# Altium schematic sheet Switches.SchDoc
size A; SheetNumber: 7
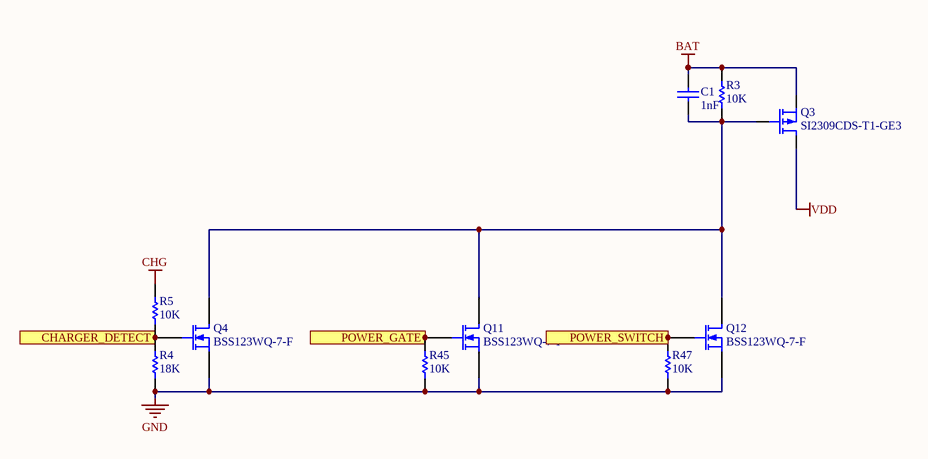
[diagram p0: Switches.SchDoc]

## Parts
C1  value 1nF  [C0603[1608X92]]  (hidden comment: 1nF 50V 0603)
Q3  SI2309CDS-T1-GE3  [SOT23-3]
Q4  BSS123WQ-7-F  [SOT323-3]
Q11  BSS123WQ-7-F  [SOT323-3]
Q12  BSS123WQ-7-F  [SOT323-3]
R3  value 10K  [R0603[1608]]  (hidden comment: 10K 1% 0603)
R4  value 18K  [R0603[1608]]  (hidden comment: 18K 1% 0603)
R5  value 10K  [R0603[1608]]  (hidden comment: 10K 1% 0603)
R45  value 10K  [R0603[1608]]  (hidden comment: 10K 1% 0603)
R47  value 10K  [R0603[1608]]  (hidden comment: 10K 1% 0603)

## Ports
CHARGER_DETECT (out), POWER_GATE (in), POWER_SWITCH (in)

## Nets
BAT: C1.2 Q3.3(S) R3.2
CHG: R5.2
GND: Q4.2(S) Q11.2(S) Q12.2(S) R4.1 R45.1 R47.1
VDD: Q3.2(D)
CHARGER_DETECT: Q4.1(G) R4.2 R5.1 ; port CHARGER_DETECT
POWER_GATE: Q11.1(G) R45.2 ; port POWER_GATE
POWER_SWITCH: Q12.1(G) R47.2 ; port POWER_SWITCH
NetC1_1: C1.1 Q3.1(G) Q4.3(D) Q11.3(D) Q12.3(D) R3.1

## Library data of the parts
C1 = CAP_1nF_50V_0603_5%: 1nF 50V 5% 0603 (1608 Metric); PartNumber: GRM1885C1H102JA01D; Manufacturer: Murata; TemperatureCoefficient: C0G; Mounting Technology: Surface Mount; PackageReference: 0603; PackageDescription: 0603 (1608 Metric); Voltage: 50V; Tolerance: 5%
Q3 = SI2309CDS-T1-GE3: P-Channel MOSFET; Manufacturer: Vishay; PackageReference: SOT23-3; Mounting Technology: Surface Mount; PartNumber: SI2309CDS-T1-GE3
Q4 Q11 Q12 = BSS123WQ-7-F: N-Channel MOSFET; Manufacturer: Diodes Incorporated; PackageReference: SOT-323-3; PartNumber: BSS123WQ-7-F; Mounting Technology: Surface Mount
R3 R5 R45 R47 = RES_10K_0603_1%: 10K 0.25W 1% 0603 (1005 Metric); Manufacturer: Vishay / Dale; PartNumber: CRCW060310K0FKEAHP; Power: 0.25W; Tolerance: 1%; Mounting Technology: Surface Mount; PackageReference: 0603; PackageDescription: 0603 (1608 Metric); ComponentLink1Description: Datasheet; ComponentLink1URL: http://www.vishay.com/docs/20065/rcse3.pdf
R4 = RES_18K_0603_1%: 18K 0.25W 1% 0603 (1005 Metric); Manufacturer: Vishay / Dale; PartNumber: CRCW060318K0FKEAHP; Tolerance: 1%; Power: 0.25W; Mounting Technology: Surface Mount; PackageReference: 0603; PackageDescription: 0603 (1608 Metric); ComponentLink1Description: Datasheet; ComponentLink1URL: http://www.vishay.com/docs/20043/crcwhpe3.pdf